# EAGLE design vds_topboard_beaglebone_revA (EAGLE 8.5.1)
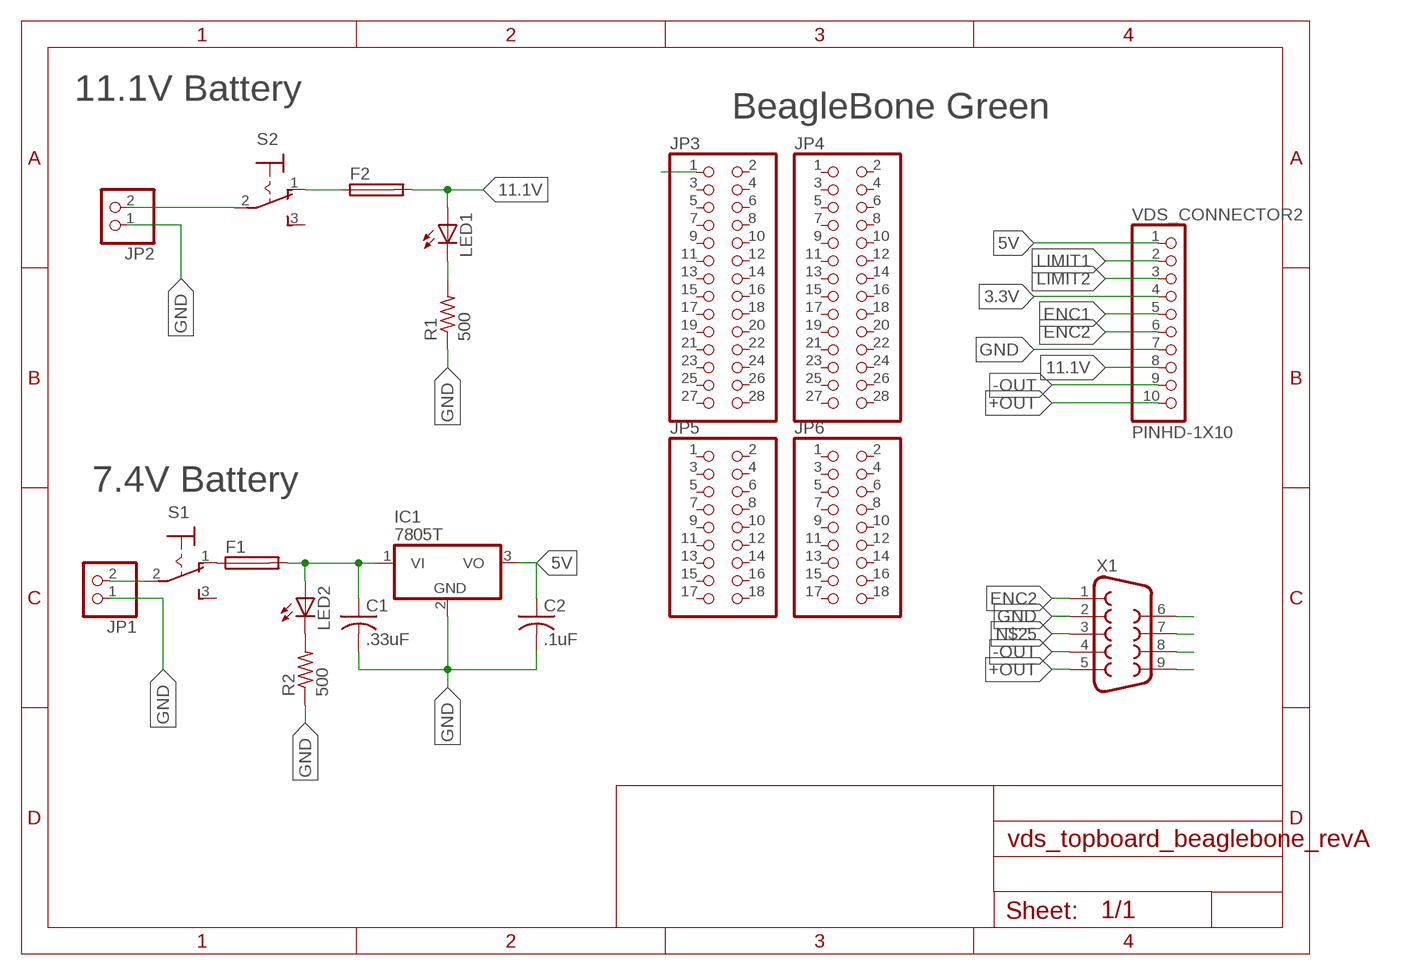
[diagram p0: schematic, sheet 1]

## Parts
C1  .33uF  C-US025-030X050  [C025-030X050]
C2  .1uF  C-US025-030X050  [C025-030X050]
F1  SH22,5  [SH22,5]
F2  SH22,5  [SH22,5]
IC1  7805T  [TO220H]
JP1  PINHD-1X2  [1X02]
JP2  PINHD-1X2  [1X02]
JP3  PINHD-2X14  [2X14]
JP4  PINHD-2X14  [2X14]
JP5  PINHD-2X9-BIG  [2X09-BIG]
JP6  PINHD-2X9-BIG  [2X09-BIG]
LED1  LED5MM  [LED5MM]
LED2  LED5MM  [LED5MM]
R1  500  R-US_0204/5  [0204/5]
R2  500  R-US_0204/5  [0204/5]
S1  320-916  [320-916]
S2  320-916  [320-916]
VDS_CONNECTOR2  PINHD-1X10  [1X10-BIG]
X1  F09VP  [F09VP]

## Nets
3.3V: VDS_CONNECTOR2.4 X1.7
5V: C2.1 IC1.3(VO) VDS_CONNECTOR2.1
7.4VO: C1.1 F1.2 IC1.1(VI) LED2.A
11.1V: F2.2 LED1.A VDS_CONNECTOR2.8
+OUT: VDS_CONNECTOR2.10 X1.5
-OUT: VDS_CONNECTOR2.9 X1.4
ENC1: VDS_CONNECTOR2.5 X1.6
ENC2: VDS_CONNECTOR2.6 X1.1
GND: C1.2 C2.2 IC1.2(GND) JP1.1 JP2.1 JP3.1 R1.1 R2.1 VDS_CONNECTOR2.7 X1.2
LIMIT1: VDS_CONNECTOR2.2 X1.9
LIMIT2: VDS_CONNECTOR2.3 X1.8
N$1: JP1.2 S1.2(P)
N$2: JP2.2 S2.2(P)
N$4: F2.1 S2.1(O)
N$5: LED1.K(C) R1.2
N$6: LED2.K(C) R2.2
N$7: F1.1 S1.1(O)
N$25: X1.3
Unconnected: JP3.2 JP3.3 JP3.4 JP3.5 JP3.6 JP3.7 JP3.8 JP3.9 JP3.10 JP3.11 JP3.12 JP3.13 JP3.14 JP3.15 JP3.16 JP3.17 JP3.18 JP3.19 JP3.20 JP3.21 JP3.22 JP3.23 JP3.24 JP3.25 JP3.26 JP3.27 JP3.28 JP4.1 JP4.2 JP4.3 JP4.4 JP4.5 JP4.6 JP4.7 JP4.8 JP4.9 JP4.10 JP4.11 JP4.12 JP4.13 JP4.14 JP4.15 JP4.16 JP4.17 JP4.18 JP4.19 JP4.20 JP4.21 JP4.22 JP4.23 JP4.24 JP4.25 JP4.26 JP4.27 JP4.28 JP5.1 JP5.2 JP5.3 JP5.4 JP5.5 JP5.6 JP5.7 JP5.8 JP5.9 JP5.10 JP5.11 JP5.12 JP5.13 JP5.14 JP5.15 JP5.16 JP5.17 JP5.18 JP6.1 JP6.2 JP6.3 JP6.4 JP6.5 JP6.6 JP6.7 JP6.8 JP6.9 JP6.10 JP6.11 JP6.12 JP6.13 JP6.14 JP6.15 JP6.16 JP6.17 JP6.18 S1.3(S) S2.3(S)

## Notes on the sheet
- 11.1V Battery
- BeagleBone Green
- 7.4V Battery

## Library data of the parts
C1 C2 = adafruit:C-US: CAPACITOR, American symbol
F1 F2 = fuse:SH22,5: FUSE HOLDER grid 22,5 mm, OGN0031 8201, Schurter (Buerklin); MF: SCHURTER; MPN: 0031.8201; OC_FARNELL: 1162740; OC_NEWARK: 96F8317
IC1 = linear:78*: Positive VOLTAGE REGULATOR Source: http://cache.national.com/ds/LM/LM78L05.pdf http://www.fairchildsemi.com/ds/LM/LM7805.pdf
JP1 JP2 = pinhead:PINHD-1X2: PIN HEADER
JP3 JP4 = adafruit:PINHD-2X14: PIN HEADER
JP5 JP6 = adafruit:PINHD-2X9: PIN HEADER With larger annulars
LED1 LED2 = adafruit:LED: LED OSRAM: - CHIPLED LG R971, LG N971, LY N971, LG Q971, LY Q971, LO R971, LY R971 LH N974, LH R974 LS Q976, LO Q976, LY Q976 LO Q996 - Hyper CHIPLED LW Q18S LB Q993, LB Q99A, LB R99A - SideLED LS A670, LO A670, LY A670, LG A670, LP A670 LB A673, LV A673, LT A673, LW A673 LH A674 LY A675 LS A676, LA A676, LO A676, LY A676, LW A676 LS A679, LY A679, LG A679 - Hyper Micro SIDELED® LS Y876, LA Y876, LO Y876, LY Y876 LT Y87S - SmartLED LW L88C, LW L88S LB L89C, LB L89S, LG L890 LS L89K, LO L89K, LY L89K LS L896, LA L896, LO L896, LY L896 - TOPLED LS T670, LO T670, LY T670, LG T670, LP T670 LSG T670, LSP T670, LSY T670, LOP T670, LYG T670 LG T671, LOG T671, LSG T671 LB T673, LV T673, LT T673, LW T673 LH T674 LS T676, LA T676, LO T676, LY T676, LB T676, LH T676, LSB T676, LW T676 LB T67C, LV T67C, LT T67C, LS T67K, LO T67K, LY T67K, LW E67C LS E67B, LA E67B, LO E67B, LY E67B, LB E67C, LV E67C, LT E67C LW T67C LS T679, LY T679, LG T679 LS T770, LO T770, LY T770, LG T770, LP T770 LB T773, LV T773, LT T773, LW T773 LH T774 LS E675, LA E675, LY E675, LS T675 LS T776, LA T776, LO T776, LY T776, LB T776 LHGB T686 LT T68C, LB T68C - Hyper Mini TOPLED® LB M676 - Mini TOPLED Santana® LG M470 LS M47K, LO M47K, LY M47K Source: http://www.osram.convergy.de/
R1 R2 = adafruit:R-US_: RESISTOR, American symbol
S1 S2 = switch:320-916: TOGGLE SWITCH distributor RS Components
VDS_CONNECTOR2 = adafruit:PINHD-1X10: Pin header 1x10 0.1" spacing With round pins
X1 = con-subd:F09: SUB-D; OC_FARNELL: unknown; OC_NEWARK: unknown

## Board
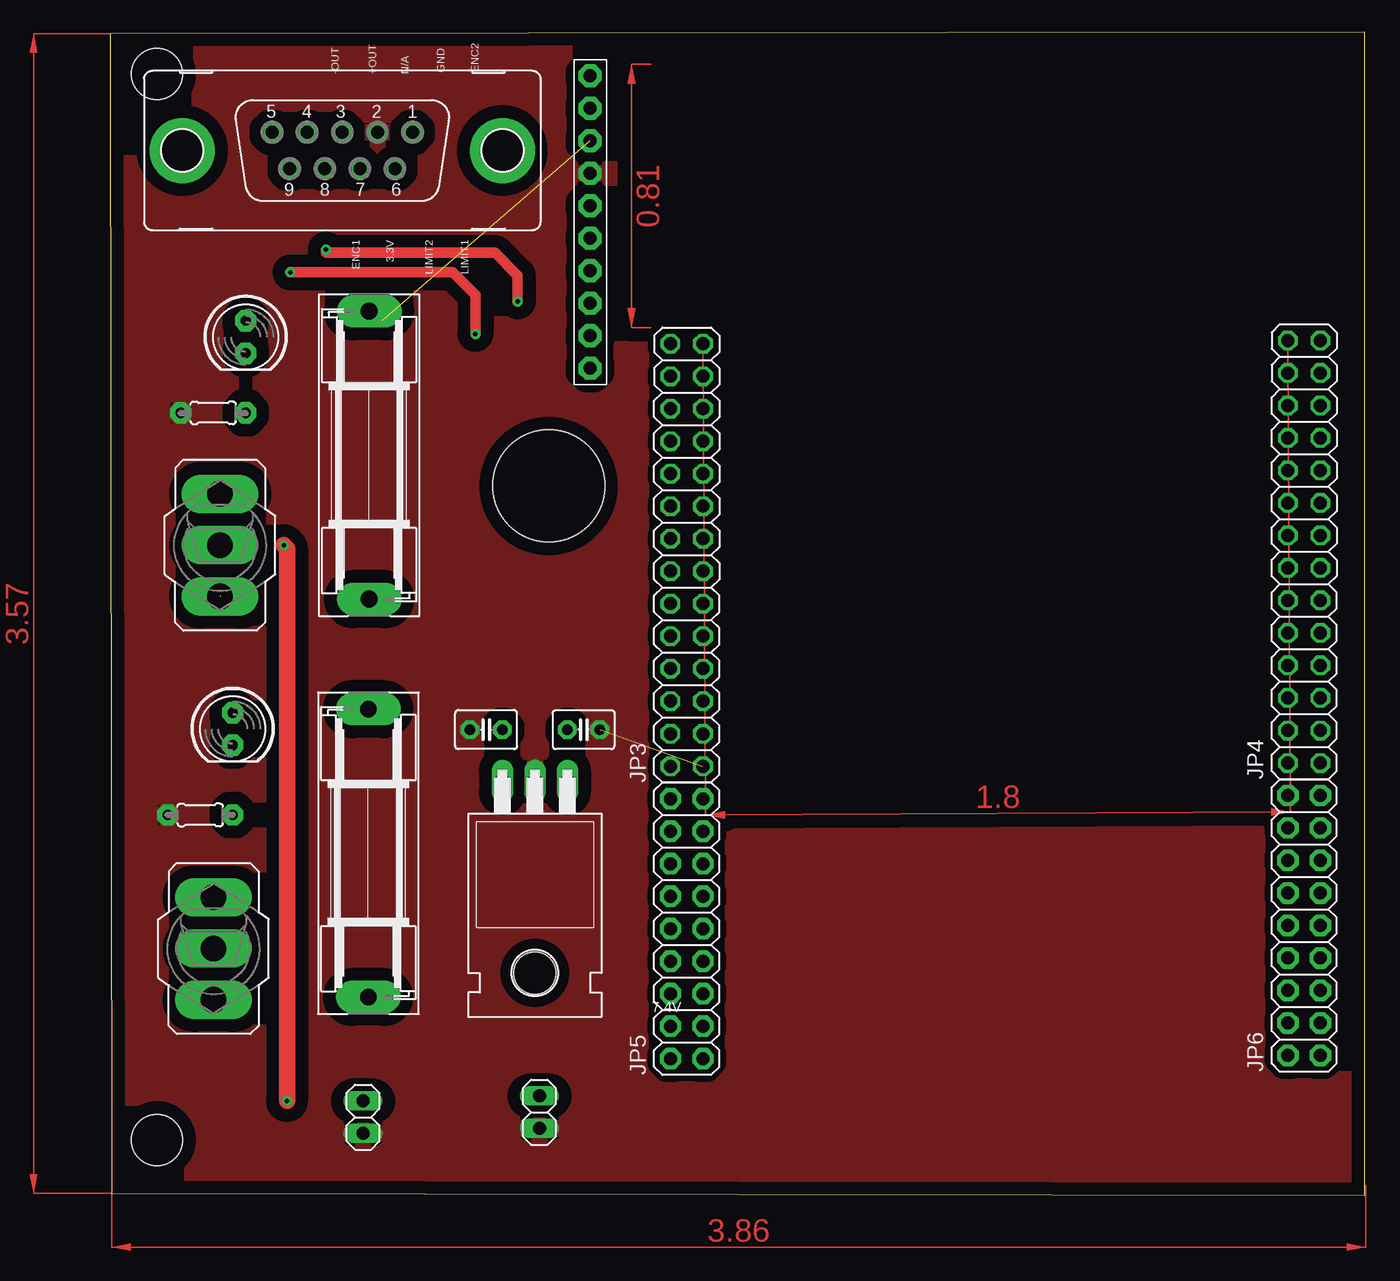
[diagram p1: board, top side]
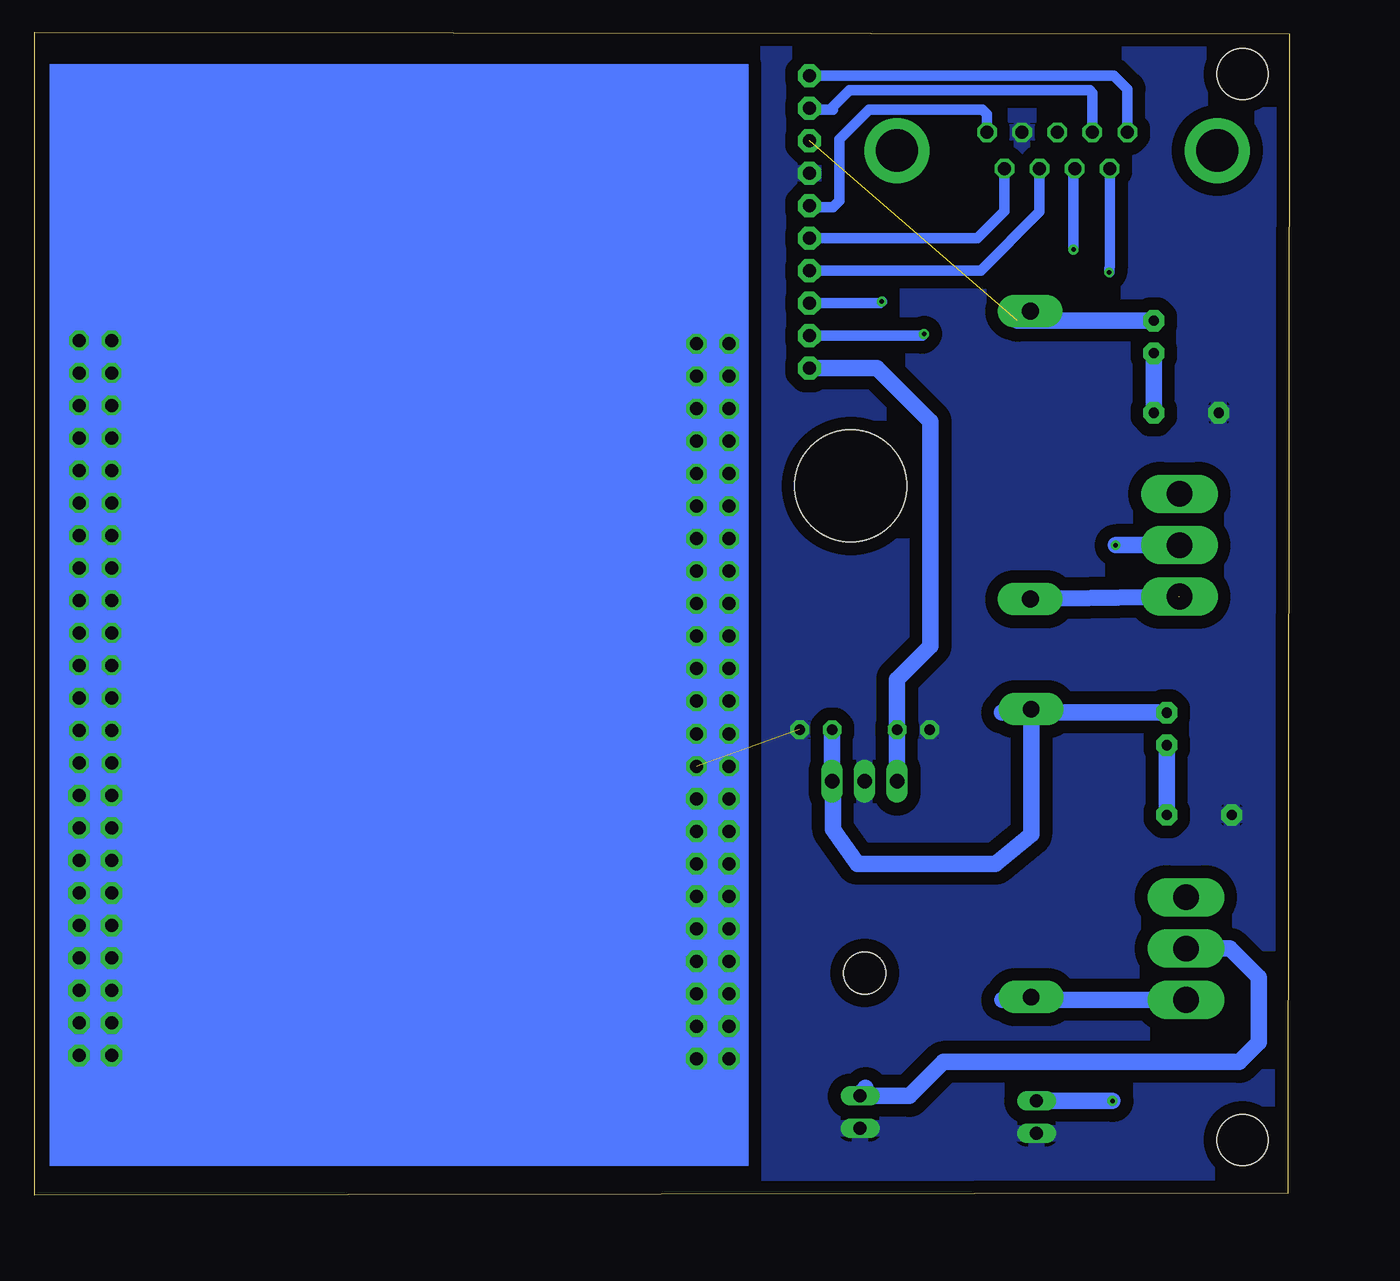
[diagram p2: board, bottom side, seen from below]

Size 98.09 x 90.92 mm. Coordinates in mm from the lower left corner, seen from the top.
Outline: 0.13,0.13 98.09,0 98.09,90.92 0,90.8 0.13,0.13
Copper layers (1*16): Top 0.035mm / dielectric 1.5mm / Bottom 0.035mm
Design rules "default *": minimum track width 10mil, minimum drill 24mil, track to track 1mm, track to pad 1mm, pad to pad 1mm, via to via 1mm, smd to smd 1mm, copper to edge 40mil, drill to drill 8mil, minimum pad ring 10mil, minimum via ring 8mil, stop-mask expansion 4mil, vias tented up to drill 0mil, thermal gap 10mil
Holes 4 mm at 3.68,4.32 3.68,87.63
Holes 8.76 mm at 34.29,55.44

### Footprints (pad centres in the part's own frame; a part is rotated, then mirrored left to right if it is on the bottom)
C025-030X050 = drill 0.813 pad 1.422 octagon: 1 -1.27,0; 2 1.27,0
SH22,5 = drill 1.321 pad 2.54 long: 1 -11.252,0; 2 11.252,0
TO220H = drill 1.118 long: 1 -2.54,-10.16; 2 0,-10.16; 3 2.54,-10.16 | hole 3.302: 0,4.826
1X02 = drill 1.016 long: 1 -1.27,0; 2 1.27,0
2X14 = drill 1.016 octagon: 1 -16.51,-1.27; 2 -16.51,1.27; 3 -13.97,-1.27; 4 -13.97,1.27; 5 -11.43,-1.27; 6 -11.43,1.27; 7 -8.89,-1.27; 8 -8.89,1.27; 9 -6.35,-1.27; 10 -6.35,1.27; 11 -3.81,-1.27; 12 -3.81,1.27; 13 -1.27,-1.27; 14 -1.27,1.27; 15 1.27,-1.27; 16 1.27,1.27; 17 3.81,-1.27; 18 3.81,1.27; 19 6.35,-1.27; 20 6.35,1.27; 21 8.89,-1.27; 22 8.89,1.27; 23 11.43,-1.27; 24 11.43,1.27; 25 13.97,-1.27; 26 13.97,1.27; 27 16.51,-1.27; 28 16.51,1.27
2X09-BIG = drill 1.016 pad 1.676 octagon: 1 -10.16,-1.27; 2 -10.16,1.27; 3 -7.62,-1.27; 4 -7.62,1.27; 5 -5.08,-1.27; 6 -5.08,1.27; 7 -2.54,-1.27; 8 -2.54,1.27; 9 0,-1.27; 10 0,1.27; 11 2.54,-1.27; 12 2.54,1.27; 13 5.08,-1.27; 14 5.08,1.27; 15 7.62,-1.27; 16 7.62,1.27; 17 10.16,-1.27; 18 10.16,1.27
LED5MM = drill 0.813 pad 1.676 octagon: A -1.27,0; K 1.27,0
0204/5 = drill 0.813 pad 1.676 octagon: 1 -2.54,0; 2 2.54,0
320-916 = drill 2.007 long: 1 0,4.013; 2 0,0; 3 0,-4.013
1X10-BIG = drill 1.016 pad 1.778 octagon: 1 -11.43,0; 2 -8.89,0; 3 -6.35,0; 4 -3.81,0; 5 -1.27,0; 6 1.27,0; 7 3.81,0; 8 6.35,0; 9 8.89,0; 10 11.43,0
F09VP = drill 1.016 octagon: 1 5.486,1.422; 2 2.743,1.422; 3 0,1.422; 4 -2.743,1.422; 5 -5.486,1.422; 6 4.115,-1.422; 7 1.372,-1.422; 8 -1.372,-1.422; 9 -4.115,-1.422 | drill 3.302 pad 5.08: G1 -12.522,0; G2 12.522,0

### Placement (x,y rotation side)
C1  37.02,36.39 0 top
C2  29.4,36.39 180 top
F1  20.19,26.73 90 top
F2  20.26,57.85 90 top
IC1  33.21,22.19 180 top
JP1  33.56,6.48 90 top
JP2  19.78,6.1 90 top
JP3  45.09,50.04 90 top
JP4  93.34,50.29 90 top
JP5  45.09,20.83 90 top
JP6  93.34,21.08 90 top
LED1  10.6,67.09 270 top
LED2  9.59,36.45 270 top
R1  8.06,61.15 0 top
R2  7.05,29.72 0 top
S1  8.1,19.27 180 top
S2  8.6,50.8 180 top
VDS_CONNECTOR2  37.53,76.07 90 top
X1  18.16,81.66 0 top

### Tracks (layer width: path | path; a pad name or v marks a point on that pad's centre or on a via)
3.3V
  Bottom 0.813: X1.7 19.53,76.86 24.13,72.26 VDS_CONNECTOR2.4
5V
  Bottom 1.27: IC1.3 C2.1 30.67,40.32 28.07,42.93 28.07,60.45 32.26,64.64 VDS_CONNECTOR2.1
7.4VO
  Bottom 1.27: C1.1 IC1.1 35.69,32.29 35.69,28.58 33.78,25.91 22.99,25.91 20.19,28.19 F1.2 22.47,37.72 LED2.A
11.1V  (1 unrouted)
  Bottom 1.27: LED1.A 21.25,68.36 F2.2
+OUT
  Bottom 0.813: X1.5 12.67,86.46 13.72,87.5 VDS_CONNECTOR2.10
-OUT
  Bottom 0.813: X1.4 15.42,86.16 15.62,86.36 34.42,86.36 35.69,85.09 35.69,84.84 37.4,84.84 VDS_CONNECTOR2.9
ENC1
  Bottom 0.813: X1.6 22.28,76.91 24.38,74.8 VDS_CONNECTOR2.5
ENC2
  Bottom 0.813: X1.1 23.65,84.48 24,84.84 32.89,84.84 35.18,82.55 35.18,77.72 35.69,77.22 37.4,77.22 VDS_CONNECTOR2.6
GND  (1 unrouted)
  pour Top: 0.13,90.93 98.17,90.93 98.17,0.25 98.17,0 -0.13,0
  pour Bottom: -0.38,90.68 98.42,90.93 98.42,0.51 0.13,0.51 0.13,0.25
LIMIT1  (via drill 0.35)
  Top 0.813: v14.1,72.14 26.8,72.14 28.58,70.36 v28.58,67.31
  Bottom 0.813: X1.9 14.05,72.9 v14.1,72.14 | v28.58,67.31 28.7,67.18 VDS_CONNECTOR2.2
LIMIT2  (via drill 0.35)
  Top 0.813: v16.89,73.91 16.89,73.66 30.1,73.66 31.88,71.88 v31.88,69.85
  Bottom 0.813: X1.8 16.89,80.24 v16.89,73.91 | v31.88,69.85 32,69.72 VDS_CONNECTOR2.3
N$1
  Bottom 1.27: S1.2 4.67,19.27 2.41,17.02 2.41,11.94 3.94,10.41 27.05,10.41 29.72,7.75 JP1.2
N$2  (via drill 0.35)
  Top 1.27: v13.59,50.8 13.84,50.55 v13.84,7.37
  Bottom 1.27: S2.2 v13.59,50.8 | v13.84,7.37 JP2.2
N$3
  Bottom 1.27: 33.15,8.38 33.4,8.13
N$4  (1 unrouted)
  Bottom 1.27: 8.64,46.79 F2.1
N$5
  Bottom 1.27: R1.2 LED1.K
N$6
  Bottom 1.27: R2.2 LED2.K
N$7
  Bottom 1.27: S1.1 22.45,15.26 F1.1
(copper drawn outside any net)
  shapes: Bottom area x1, Top area x4

### Text on the board
tPlace: -OUT | +OUT | N/A | GND | ENC2 | ENC1 | 3.3V | LIMIT2 | LIMIT1 | 7.4V